# EAGLE schematic BEP32_Schematic (EAGLE 6.5.0)
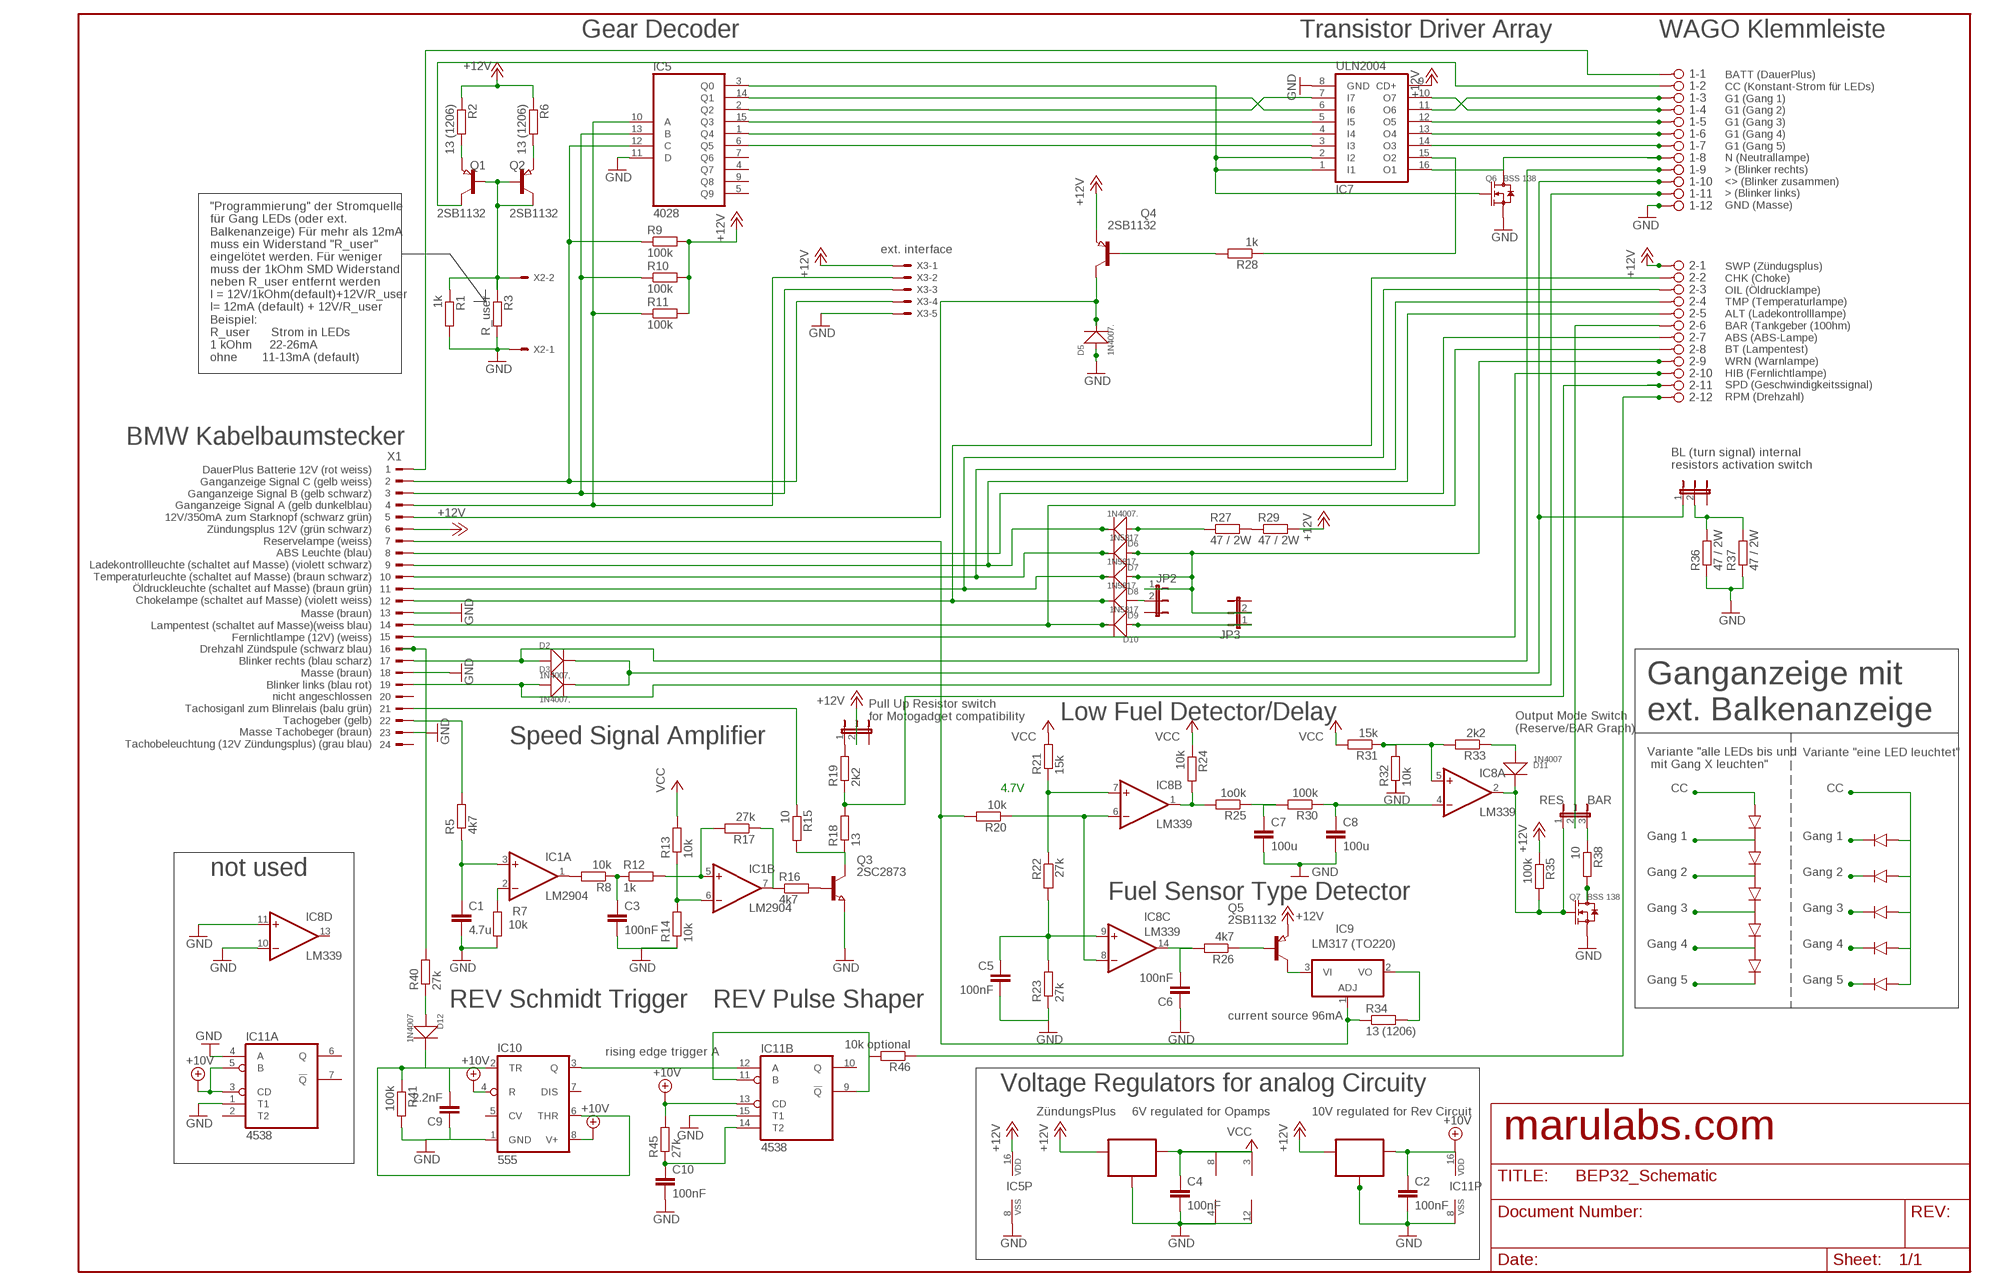
[diagram p0: schematic, sheet 1]

## Parts
1  2081-1132  [12-PIN]
2  2081-1132  [12-PIN]
C1  4.7u  C-EUC0805  [C0805]
C2  100nF  C-EUC0805  [C0805]
C3  100nF  C-EUC0805  [C0805]
C4  100nF  C-EUC0805  [C0805]
C5  100nF  C-EUC0805  [C0805]
C6  100nF  C-EUC0805  [C0805]
C7  100u  C-EUC1206K  [C1206K]
C8  100u  C-EUC1206K  [C1206K]
C9  2.2nF  C-EUC0805  [C0805]
C10  100nF  C-EUC0805  [C0805]
D2  1N4007,  DIODE-GEN-PURPOSE-1KV-1A(DO-214AC)  [DO-214AC]
D3  1N4007,  DIODE-GEN-PURPOSE-1KV-1A(DO-214AC)  [DO-214AC]
D5  1N4007.  DIODE-GEN-PURPOSE-1KV-1A(DO-214AC)  [DO-214AC]
D6  1N4007.  DIODE-GEN-PURPOSE-1KV-1A(DO-214AC)  [DO-214AC]
D7  1N5817  DIODE-GEN-PURPOSE-1KV-1A(DO-214AC)DO-214AC/1206  [DO-214AC_SLIM]
D8  1N5817.  DIODE-GEN-PURPOSE-1KV-1A(DO-214AC)DO-214AC/1206  [DO-214AC_SLIM]
D9  1N5817.  DIODE-GEN-PURPOSE-1KV-1A(DO-214AC)DO-214AC/1206  [DO-214AC_SLIM]
D10  1N5817  DIODE-GEN-PURPOSE-1KV-1A(DO-214AC)DO-214AC/1206  [DO-214AC_SLIM]
D11  1N4007  DIODE-GEN-PURPOSE-1KV-1A(DO-214AC)  [DO-214AC]
D12  1N4007  DIODE-GEN-PURPOSE-1KV-1A(DO-214AC)  [DO-214AC]
IC1  LM2904  LM358D  [SO08]
IC2  78L06  78LXXSOT89_ROUND  [SOT89_ROUND]
IC4  78L10  78LXXSOT89_ROUND  [SOT89_ROUND]
IC5  4028  4028D  [SO16]
IC7  ULN2004  ULN2004AD  [SO16]
IC8  LM339  LM339D  [SO14]
IC9  317TO202H_NOHOLE  [TO220H_NOHOLE]
IC10  555  NE555D  [SO08]
IC11  4538  4538D  [SO16]
JP1  JP2EJP2_SMALLPADS  [JP2_SMALLPADS]
JP2  JP2EJP2_SMALLPADS  [JP2_SMALLPADS]
JP3  JP2EJP2_SMALLPADS  [JP2_SMALLPADS]
JP4  JP2EJP2_SMALLPADS  [JP2_SMALLPADS]
JP5  JP2E_ORIG  [JP2_ORIG_SMALLPADS]
Q1  2SB1132  PNP-TRANSISTOR_SOT89  [SOT89]
Q2  2SB1132  PNP-TRANSISTOR_SOT89  [SOT89]
Q3  2SC2873  NPN-TRANSISTOR_SOT89  [SOT89]
Q4  2SB1132  PNP-TRANSISTOR_SOT89  [SOT89]
Q5  2SB1132  PNP-TRANSISTOR_SOT89  [SOT89]
Q6  BSS 138  SMD-MOSFET-N-CH-50V-200MA-BSS138W-7-F(SOT-23)  [SOT-23]
Q7  BSS 138  SMD-MOSFET-N-CH-50V-200MA-BSS138W-7-F(SOT-23)  [SOT-23]
R1  1k  R-EU_R0805  [R0805]
R2  13 (1206)  R-EU_R0805  [R0805]
R3  R_user  R-EU_R0805  [R0805]
R5  4k7  R-EU_R0805  [R0805]
R6  13 (1206)  R-EU_R0805  [R0805]
R7  10k  R-EU_R0805  [R0805]
R8  10k  R-EU_R0805  [R0805]
R9  100k  R-EU_R0805  [R0805]
R10  100k  R-EU_R0805  [R0805]
R11  100k  R-EU_R0805  [R0805]
R12  1k  R-EU_R0805  [R0805]
R13  10k  R-EU_R0805  [R0805]
R14  10k  R-EU_R0805  [R0805]
R15  10  R-EU_R0805  [R0805]
R16  4k7  R-EU_R0805  [R0805]
R17  27k  R-EU_R0805  [R0805]
R18  13  R-EU_R0805  [R0805]
R19  2k2  R-EU_R0805  [R0805]
R20  10k  R-EU_R0805  [R0805]
R21  15k  R-EU_R0805  [R0805]
R22  27k  R-EU_R0805  [R0805]
R23  27k  R-EU_R0805  [R0805]
R24  10k  R-EU_R0805  [R0805]
R25  1o0k  R-EU_R0805  [R0805]
R26  4k7  R-EU_R0805  [R0805]
R27  47 / 2W  R-EU_R0805  [R0805]
R28  1k  R-EU_R0805  [R0805]
R29  47 / 2W  R-EU_R0805  [R0805]
R30  100k  R-EU_R0805  [R0805]
R31  15k  R-EU_R0805  [R0805]
R32  10k  R-EU_R0805  [R0805]
R33  2k2  R-EU_R0805  [R0805]
R34  13 (1206)  R-EU_R0805  [R0805]
R35  100k  R-EU_R0805  [R0805]
R36  47 / 2W  R-EU_R0805  [R0805]
R37  47 / 2W  R-EU_R0805  [R0805]
R38  10  R-EU_R0805  [R0805]
R40  27k  R-EU_R0805  [R0805]
R41  100k  R-EU_R0805  [R0805]
R45  27k  R-EU_R0805  [R0805]
R46  10k optional  R-EU_R0805  [R0805]
X1  CON_BMWV2  [24-PIN_V2]
X2  22-23-2021  [22-23-2021]
X3  22-23-2051  [22-23-2051]

## Nets
+10V: C2.1 IC4.1(OUT) IC10.4(R) IC10.8(V+) IC11.3(A:CD) IC11.5(A:B) IC11.13(B:CD) IC11.16(P:VDD) R45.2
+12V: 2.1 IC2.3(IN) IC4.3(IN) IC5.16(VDD) IC7.9(CD+) Q4.3(E) Q5.3(E) R2.1 R6.1 R9.2 R10.2 R11.2 R29.2 R35.1 X1.6 X3.1
+12V1: IC1.7(B:OUT) R16.1 R17.1
GND: 1.12 C1.2 C2.2 C3.2 C4.2 C5.2 C6.1 C7.2 C8.2 C10.2 D5.1(+) IC1.4(P:V-) IC2.2(GND) IC2.2@1(GND) IC4.2(GND) IC4.2@1(GND) IC5.8(VSS) IC5.11(D) IC7.8(GND) IC8.10(D:-IN) IC8.11(D:+IN) IC8.12(P:GND) IC10.1(GND) IC11.1(A:T1) IC11.4(A:A) IC11.8(P:VSS) IC11.15(B:T1) Q3.3(E) Q6.2(S) Q7.2(S) R1.2 R3.2 R7.1 R14.1 R23.1 R36.1 R37.1 R41.2 X1.13 X1.18 X1.23 X2.1 X3.5
N$1: 2.9 D7.1(+) D8.1(+) JP2.1 JP3.2
N$2: IC5.10(A) R11.1 X1.4 X3.2
N$3: IC5.13(B) R10.1 X1.3 X3.3
N$4: 2.7 X1.8
N$5: Q1.3(E) R2.2
N$6: D11.2(-) IC8.2(A:OUT) JP5.1 Q7.1(G) R35.2
N$7: IC1.2(A:-IN) R7.2
N$8: R27.2 R29.1
N$9: Q2.3(E) R6.2
N$11: D5.2(-) Q4.2(C) X1.5
N$12: 2.2 D9.2(-) X1.12
N$13: 2.3 D8.2(-) X1.11
N$14: 2.4 D7.2(-) X1.10
N$15: IC9.3(VI) Q5.2(C)
N$16: IC8.6(B:-IN) IC8.8(C:-IN) R20.1
N$17: IC5.12(C) R9.1 X1.2 X3.4
N$18: IC5.15(Q3) IC7.5(I5)
N$19: 2.8 D10.2(-) X1.14
N$20: 1.9 D2.1(+) X1.17
N$21: 1.11 D3.1(+) X1.19
N$22: IC11.9(B:!Q) IC11.11(B:B) R46.2
N$23: R5.2 X1.22
N$24: C1.1 IC1.3(A:+IN) R5.1
N$25: 1.6 IC7.13(O4)
N$26: 1.7 IC7.14(O3)
N$27: 2.11 R18.2 R19.1
N$28: 2.6 JP5.2
N$29: JP1.1 R19.2
N$30: C5.1 IC8.9(C:+IN) R22.2 R23.2
N$31: C6.2 IC8.14(C:OUT) R26.2
N$32: D12.2(-) IC10.2(TR) IC10.6(THR) R41.1
N$35: IC9.1(ADJ) R20.2 R34.1 X1.7
N$36: Q5.1(B) R26.1
N$37: IC5.2(Q2) IC7.7(I7)
N$38: 1.3 IC7.11(O6)
N$39: 1.5 IC7.12(O5)
N$40: Q4.1(B) R28.2
N$41: C9.1
N$42: R40.2 X1.16
N$43: C9.2
N$44: IC5.3(Q0) IC7.1(I1) IC7.2(I2) Q6.1(G)
N$45: C7.1 R25.1 R30.2
N$46: C8.1 IC8.4(A:-IN) R30.1
N$47: IC8.5(A:+IN) R31.1 R32.2 R33.2
N$48: Q7.3(D) R38.2
N$49: D11.1(+) R33.1
N$50: IC5.1(Q4) IC7.4(I4)
N$51: R15.1 X1.21
N$52: 1.8 IC7.16(O1) Q6.3(D)
N$53: 2.10 X1.15
N$54: D6.1(+) R27.1
N$55: 2.5 D6.2(-) X1.9
N$56: IC5.14(Q1) IC7.6(I6)
N$57: Q1.1(B) Q2.1(B) Q2.2(C) R1.1 R3.1 X2.2
N$58: Q3.2(C) R15.2 R18.1
N$59: 1.2 Q1.2(C)
N$61: IC5.6(Q5) IC7.3(I3)
N$64: IC9.2(VO) R34.2
N$67: 1.4 IC7.10(O7)
N$69: 1.1 X1.1
N$83: IC8.7(B:+IN) R21.1 R22.1
N$85: Q3.1(B) R16.2
N$86: IC10.3(Q) IC11.12(B:A)
N$87: D12.1(+) R40.1
N$88: IC7.15(O2) R28.1
N$89: C10.1 IC11.14(B:T2) R45.1
N$90: 2.12 R46.1
N$92: IC1.1(A:OUT) R8.2
N$93: 1.10 D2.2(-) D3.2(-) JP4.1
N$94: JP4.2 R36.2 R37.2
N$95: D9.1(+) JP2.2
N$96: C3.1 R8.1 R12.1
N$97: IC1.5(B:+IN) R12.2 R17.2
N$98: D10.1(+) JP3.1
N$99: JP5.3 R38.1
N$101: IC1.6(B:-IN) R13.1 R14.2
N$580: IC8.1(B:OUT) R24.2 R25.2
VCC: C4.1 IC1.8(P:V+) IC2.1(OUT) IC8.3(P:V+) R13.2 R21.2 R24.1 R31.2
Unconnected: IC5.4(Q7) IC5.5(Q9) IC5.7(Q6) IC5.9(Q8) IC8.13(D:OUT) IC10.5(CV) IC10.7(DIS) IC11.2(A:T2) IC11.6(A:Q) IC11.7(A:!Q) IC11.10(B:Q) JP1.2 R32.1 X1.20 X1.24

## Notes on the sheet
- Gear Decoder | Transistor Driver Array | WAGO Klemmleiste
- BATT (DauerPlus)
  CC (Konstant-Strom für LEDs)
  G1 (Gang 1)
  G1 (Gang 2)
  G1 (Gang 3)
  G1 (Gang 4)
  G1 (Gang 5)
  N (Neutrallampe)
  > (Blinker rechts)
  <> (Blinker zusammen)
  > (Blinker links)
  GND (Masse)
- ext. interface
- SWP (Zündugsplus)
  CHK (Choke)
  OIL (Öldrucklampe)
  TMP (Temperaturlampe)
  ALT (Ladekontrolllampe)
  BAR (Tankgeber (100hm)
  ABS (ABS-Lampe)
  BT (Lampentest)
  WRN (Warnlampe)
  HIB (Fernlichtlampe)
  SPD (Geschwindigkeitssignal)
  RPM (Drehzahl)
- "Programmierung" der Stromquelle
  für Gang LEDs (oder ext. 
  Balkenanzeige) Für mehr als 12mA
  muss ein Widerstand "R_user"
  eingelötet werden. Für weniger
  muss der 1kOhm SMD Widerstand
  neben R_user entfernt werden
  I = 12V/1kOhm(default)+12V/R_user
  I= 12mA (default) + 12V/R_user
  Beispiel:
  R_user      Strom in LEDs
  1 kOhm     22-26mA
  ohne       11-13mA (default)
- BMW Kabelbaumstecker
- BL (turn signal) internal 
  resistors activation switch
- DauerPlus Batterie 12V (rot weiss)
  Ganganzeige Signal C (gelb weiss)
  Ganganzeige Signal B (gelb schwarz)
  Ganganzeige Signal A (gelb dunkelblau)
  12V/350mA zum Starknopf (schwarz grün)
  Zündungsplus 12V (grün schwarz)
  Reservelampe (weiss)
  ABS Leuchte (blau)
  Ladekontrollleuchte (schaltet auf Masse) (violett schwarz)
  Temperaturleuchte (schaltet auf Masse) (braun schwarz)
  Öldruckleuchte (schaltet auf Masse) (braun grün)
  Chokelampe (schaltet auf Masse) (violett weiss)
- Masse (braun)
  Lampentest (schaltet auf Masse)(weiss blau)
  Fernlichtlampe (12V) (weiss)
  Drehzahl Zündspule (schwarz blau)
  Blinker rechts (blau scharz)
  Masse (braun)
  Blinker links (blau rot)
  nicht angeschlossen
  Tachosiganl zum Blinrelais (balu grün)
  Tachogeber (gelb)
  Masse Tachobeger (braun)
  Tachobeleuchtung (12V Zündungsplus) (grau blau)
- Pull Up Resistor switch
  for Motogadget compatibility
- Low Fuel Detector/Delay
- Ganganzeige mit
  ext. Balkenanzeige
- Output Mode Switch
  (Reserve/BAR Graph)
- Speed Signal Amplifier
- Variante "eine LED leuchtet"
- Variante "alle LEDs bis und
   mit Gang X leuchten"
- 4.7V | CC | CC
- RES | BAR
- Gang 1 | Gang 1
- not used | Gang 2 | Gang 2
- Fuel Sensor Type Detector
- Gang 3 | Gang 3
- Gang 4 | Gang 4
- Gang 5 | Gang 5
- REV Schmidt Trigger | REV Pulse Shaper
- current source 96mA
- rising edge trigger A
- Voltage Regulators for analog Circuity
- ZündungsPlus | 6V regulated for Opamps | 10V regulated for Rev Circuit
- marulabs.com

## Library data of the parts
1 2 = con WAGO BMW:2081-1132: WAGO SREW CLAMP
C1-C10 = rcl:C-EU: CAPACITOR, European symbol
D2 D3 D5 D6 = Diode-do214ac:DIODE-GEN-PURPOSE-1KV-1A(DO-214AC): 304010013; MPN: 1N4007; VALUE: 1N4007
D7-D10 = Diode-do214ac:DIODE-GEN-PURPOSE-1KV-1A(DO-214AC): 304010013
D11 D12 = Diode-do214ac:DIODE-GEN-PURPOSE-1KV-1A(DO-214AC): 304010013; MPN: 1N4007
IC1 = linear_BMW:LM358: OP AMP also LM158; LM258; LM2904 Source: http://cache.national.com/ds/LM/LM158.pdf
IC2 IC4 = 78LXX:78LXX
IC5 = 4028:4028: BCD to decimal DECODER
IC7 = uln-udn:ULN2004A: DRIVER ARRAY
IC8 = LM339:LM339: Low Power Low Offset Voltage Quad Comparators with open collector; LM139/LM239/LM339/LM2901/LM3302
IC9 = linear_BMW:*317: Positive VOLTAGE REGULATOR; IC9: LM317 (TO220)
IC10 = linear:*555: TIMER
IC11 = 45xx:4538: Dual precision monostable MULTIVIBRATOR
JP1-JP4 = Switch Aliexpress 2:JP2E: JUMPER
JP5 = Switch Aliexpress 2:JP2E_ORIG
Q1 Q2 Q4 Q5 = Transistor_SOT89:PNP-TRANSISTOR_: PNP TRANSISTOR
Q3 = Transistor_SOT89:NPN-TRANSISTOR_: NPN TRANSISTOR
Q6 Q7 = Seeed-Transistor-2016:SMD-MOSFET-N-CH-50V-200MA-BSS138W-7-F(SOT-23): 305030000; MPN: BSS138W-7-F; VALUE: BSS138W-7-F
R1-R3 R5-R38 R40 R41 R45 R46 = rcl:R-EU_: RESISTOR, European symbol
X1 = con_BMW:CON_BMW: BMW CONNECTOR
X2 = con_Molex_BMW:22-23-2021: .100" (2.54mm) Center Header - 2 Pin; MF: MOLEX; MPN: 22-23-2021; OC_FARNELL: 1462926; OC_NEWARK: 25C3832
X3 = con_Molex_BMW:22-23-2051: .100" (2.54mm) Center Header - 5 Pin; MF: MOLEX; MPN: 22-23-2051; OC_FARNELL: 1462952; OC_NEWARK: 38C9178